# EAGLE design Pico_26Pin_FPC_Adapter (EAGLE 9.6.2)
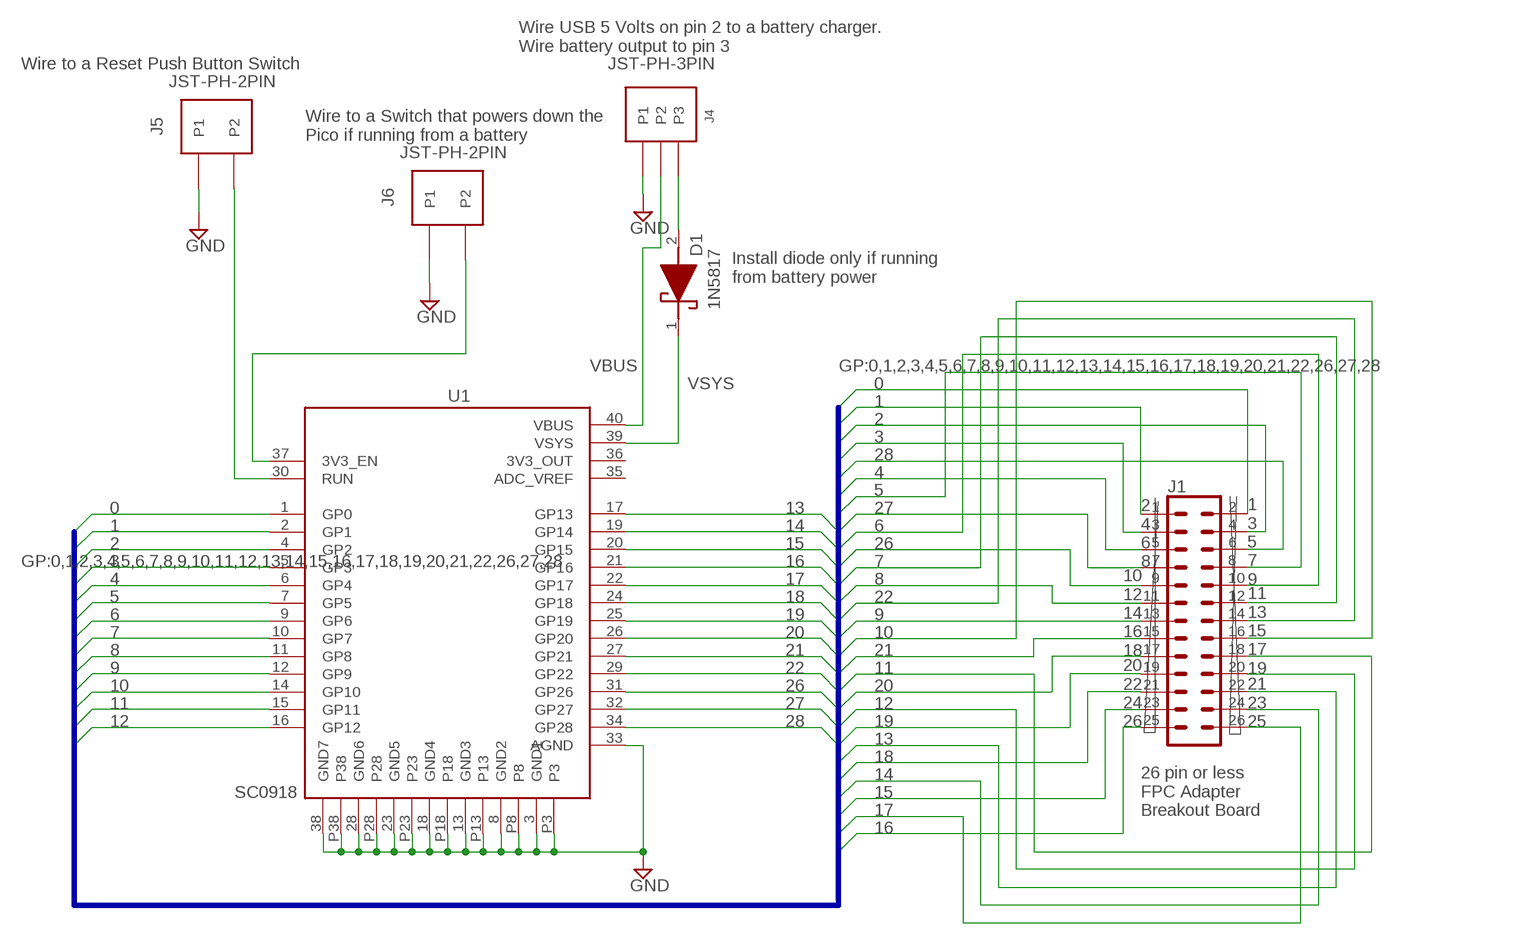
[diagram p0: schematic, sheet 1]

## Parts
D1  1N5817  [DIOAD1410W86L470D235]
J1  CONN_13X22X13  [2X13]
J4  JST-PH-3PIN  [JST-PH-3PIN]
J5  JST-PH-2PIN  [JST-PH-2PIN]
J6  JST-PH-2PIN  [JST-PH-2PIN]
U1  SC0918  [MODULE_SC0918]

## Nets
0: J1.2 U1.1(GP0)
1: J1.1 U1.2(GP1)
2: J1.4 U1.4(GP2)
3: J1.3 U1.5(GP3)
4: J1.5 U1.6(GP4)
5: J1.8 U1.7(GP5)
6: J1.10 U1.9(GP6)
7: J1.12 U1.10(GP7)
8: J1.11 U1.11(GP8)
9: J1.13 U1.12(GP9)
10: J1.16 U1.14(GP10)
11: J1.18 U1.15(GP11)
12: J1.20 U1.16(GP12)
13: J1.22 U1.17(GP13)
14: J1.24 U1.19(GP14)
15: J1.23 U1.20(GP15)
16: J1.25 U1.21(GP16)
17: J1.26 U1.22(GP17)
18: J1.21 U1.24(GP18)
19: J1.19 U1.25(GP19)
20: J1.17 U1.26(GP20)
21: J1.15 U1.27(GP21)
22: J1.14 U1.29(GP22)
26: J1.9 U1.31(GP26)
27: J1.7 U1.32(GP27)
28: J1.6 U1.34(GP28)
GND: J4.P$1(P1) J5.P$1(P1) J6.P$1(P1) U1.3(GND1) U1.8(GND2) U1.13(GND3) U1.18(GND4) U1.23(GND5) U1.28(GND6) U1.33(AGND) U1.38(GND7) U1.P3 U1.P8 U1.P13 U1.P18 U1.P23 U1.P28 U1.P38
N$1: J5.P$2(P2) U1.30(RUN)
N$2: J6.P$2(P2) U1.37(3V3_EN)
VBAT: D1.2(A) J4.P$3(P3)
VBUS: J4.P$2(P2) U1.40(VBUS)
VSYS: D1.1(K) U1.39(VSYS)

## Buses
GP:0,1,2,3,4,5,6,7,8,9,10,11,12,13,14,15,16,17,18,19,20,21,22,26,27,28

## Notes on the sheet
- Wire USB 5 Volts on pin 2 to a battery charger.
  Wire battery output to pin 3
- Wire to a Reset Push Button Switch
- Wire to a Switch that powers down the
  Pico if running from a battery
- Install diode only if running 
  from battery power
- 2
  4
  6
  8
- 1
  3
  5
  7
  9
- 10
  12
  14
  16
  18
- 11
  13
  15
  17
  19
- 20
  22
  24
  26
- 21
  23
  25
- 26 pin or less
  FPC Adapter
  Breakout Board

## Power pins joined to a net without a drawn wire
3V3_OUT: U1.36(3V3_OUT)
ADC_VREF: U1.35(ADC_VREF)

## Library data of the parts
D1 = SamacSys_Parts:1N5817: Schottky Diodes & Rectifiers 1A, 20V, Schottky Rectifier Source: Datasheet <https://services.taiwansemi.com/storage/resources/datasheet/1N5817 SERIES_H2104.pdf>; DESCRIPTION: Schottky Diodes & Rectifiers 1A, 20V, Schottky Rectifier; HEIGHT: mm; MANUFACTURER_NAME: Taiwan Semiconductor; MANUFACTURER_PART_NUMBER: 1N5817; MOUSER_PART_NUMBER: 821-1N5817; MOUSER_PRICE-STOCK: https://www.mouser.co.uk/ProductDetail/Taiwan-Semiconductor/1N5817?qs=G5AQjGfRJcITga2hz4Rc2w%3D%3D
J1 = SparkFun-Connectors:CONN_13X2: Multi connection point. Often used as Generic Header-pin footprint for 0.1 inch spaced/style header connections On any of the 0.1 inch spaced packages, you can populate with these: Break Away Headers - Straight <https://www.sparkfun.com/products/116> (PRT-00116) Break Away Male Headers - Right Angle <https://www.sparkfun.com/products/553> (PRT-00553) Female Headers <https://www.sparkfun.com/products/115> (PRT-00115) Break Away Headers - Machine Pin <https://www.sparkfun.com/products/117> (PRT-00117) Break Away Female Headers - Swiss Machine Pin <https://www.sparkfun.com/products/743> (PRT-00743)
J4 = JST-PH-3PIN:JST-PH-3PIN
J5 J6 = JST-PH-2PIN:JST-PH-2PIN
U1 = SC0918:SC0918: Check availability <https://pricing.snapeda.com/parts/SC0918/Raspberry%20Pi/view-part?ref=eda>; AVAILABILITY: In Stock; CHECK_PRICES: https://www.snapeda.com/parts/SC0918/Raspberry+Pi/view-part/?ref=eda; DESCRIPTION: - RP2040 Transceiver; 802.11 b/g/n (Wi-Fi, WiFi, WLAN), Bluetooth® 5.x 2.4GHz Evaluation Board; MF: Raspberry Pi; MP: SC0918; PACKAGE: None; PRICE: None; SNAPEDA_LINK: https://www.snapeda.com/parts/SC0918/Raspberry+Pi/view-part/?ref=snap

## Board
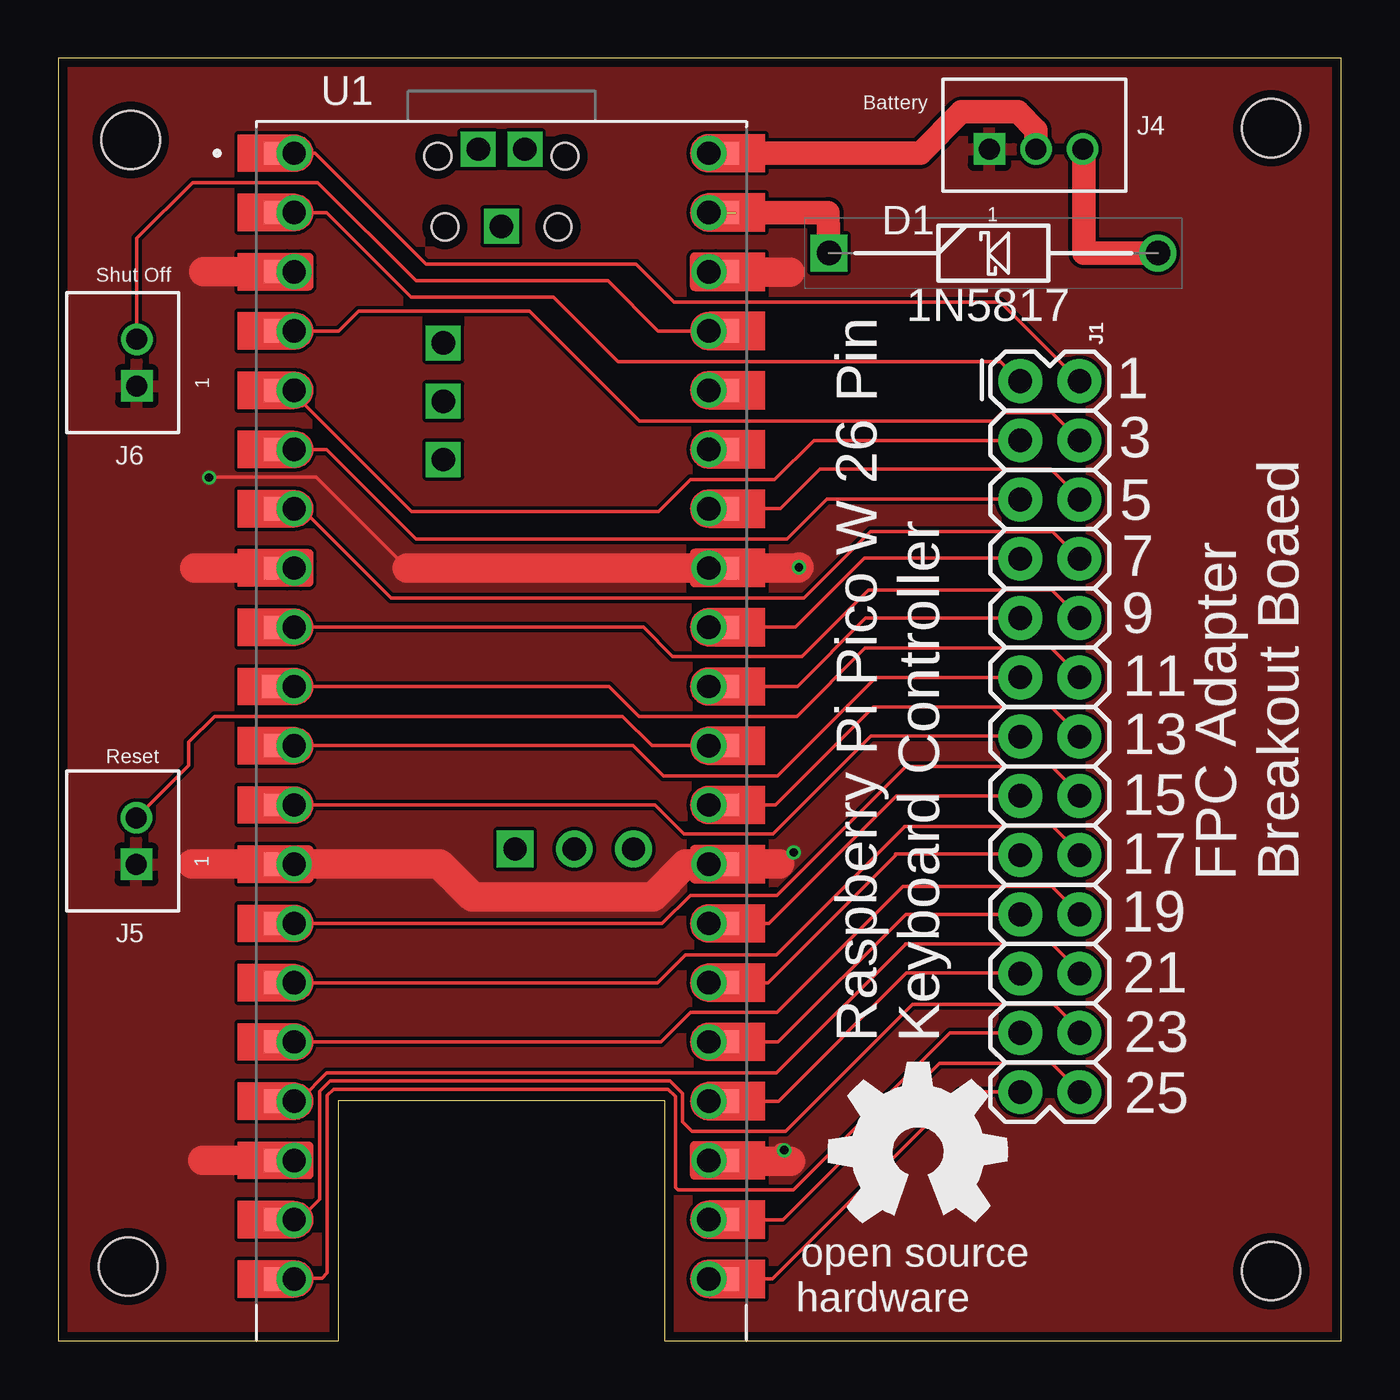
[diagram p1: board, top side]
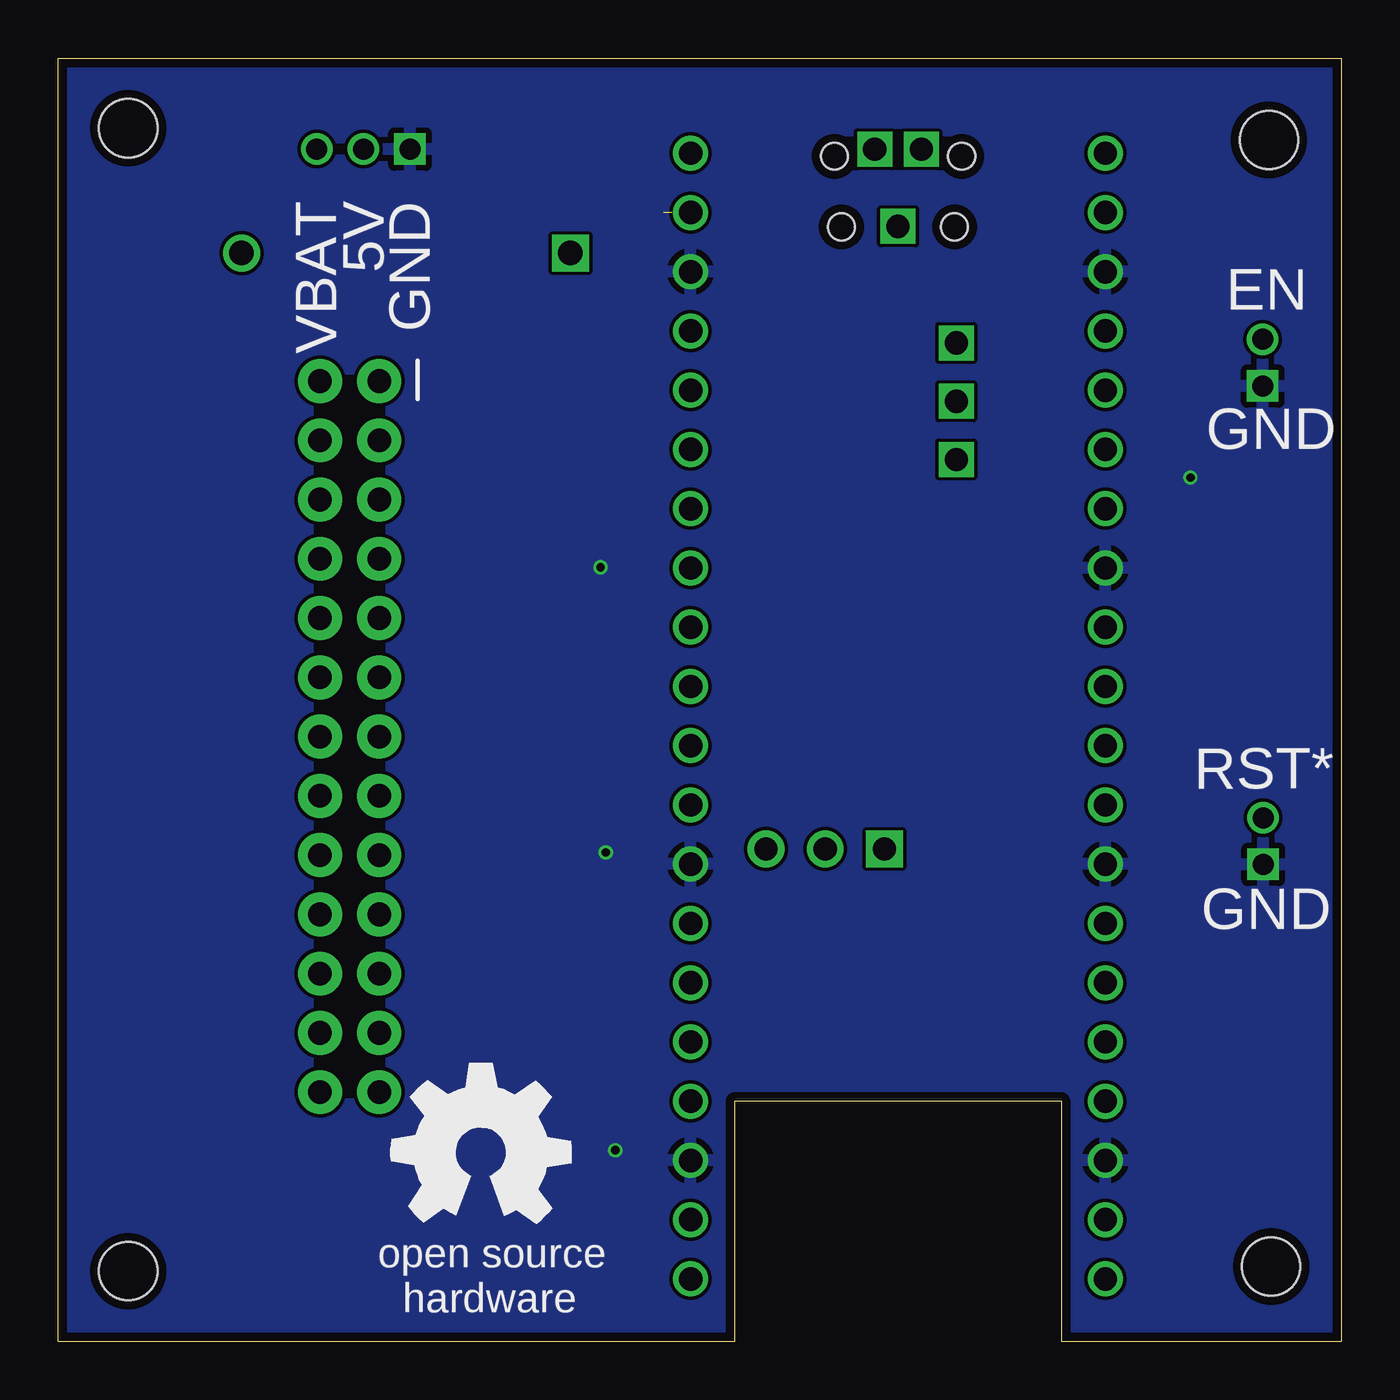
[diagram p2: board, bottom side, seen from below]

Size 55 x 55 mm. Coordinates in mm from the lower left corner, seen from the top.
Outline: 55,0 55,55 0,55 0,0 12,0 12,10.3 26,10.3 26,0 55,0
Copper layers (1*16): Top 0.035559375mm / dielectric 1.6mm / Bottom 0.035559375mm
Design rules "oshpark-2layer": minimum track width 6mil, minimum drill 10mil, track to track 6mil, track to pad 6mil, pad to pad 6mil, via to via 6mil, smd to smd 6mil, copper to edge 15mil, drill to drill 6mil, minimum pad ring 5mil, minimum via ring 5mil, stop-mask expansion 2.5mil, vias tented up to drill 0mil, thermal gap 10mil
Holes 2.5 mm at 52,52 52,3 3,3.2 3.1,51.5

### Footprints (pad centres in the part's own frame; a part is rotated, then mirrored left to right if it is on the bottom)
DIOAD1410W86L470D235 = drill 1.05 pad 1.575 square: 1 0,0 | drill 1.05 pad 1.575: 2 14.1,0
2X13 = drill 1.016 pad 1.88: 1 0,0; 2 0,2.54; 3 2.54,0; 4 2.54,2.54; 5 5.08,0; 6 5.08,2.54; 7 7.62,0; 8 7.62,2.54; 9 10.16,0; 10 10.16,2.54; 11 12.7,0; 12 12.7,2.54; 13 15.24,0; 14 15.24,2.54; 15 17.78,0; 16 17.78,2.54; 17 20.32,0; 18 20.32,2.54; 19 22.86,0; 20 22.86,2.54; 21 25.4,0; 22 25.4,2.54; 23 27.94,0; 24 27.94,2.54; 25 30.48,0; 26 30.48,2.54
JST-PH-3PIN = drill 0.9 square: P$1 -2.98,0.01 | drill 0.9: P$2 -0.98,0.01; P$3 1.02,0.01
JST-PH-2PIN = drill 0.9 square: P$1 -1,0 | drill 0.9: P$2 1,0
MODULE_SC0918 = smd 1 x 1: 1 -9.69,24.13; 2 -9.69,21.59; 3 -9.69,19.05; 4 -9.69,16.51; 5 -9.69,13.97; 6 -9.69,11.43; 7 -9.69,8.89; 8 -9.69,6.35; 9 -9.69,3.81; 10 -9.79,1.27; 11 -9.69,-1.27; 12 -9.69,-3.81; 13 -9.69,-6.35; 14 -9.69,-8.89; 15 -9.69,-11.43; 16 -9.69,-13.97; 17 -9.69,-16.51; 18 -9.69,-19.05; 19 -9.69,-21.59; 20 -9.69,-24.13; 21 9.69,-24.13; 22 9.69,-21.59; 23 9.69,-19.05; 24 9.69,-16.51; 25 9.69,-13.97; 26 9.69,-11.43; 27 9.69,-8.89; 28 9.69,-6.35; 29 9.69,-3.81; 30 9.69,-1.27; 31 9.69,1.27; 32 9.69,3.81; 33 9.69,6.35; 34 9.69,8.89; 35 9.69,11.43; 36 9.69,13.97; 37 9.69,16.51; 38 9.69,19.05; 39 9.69,21.59; 40 9.69,24.13 | drill 1 pad 1.575 square: E 0.584,-5.7 | drill 1 pad 1.575: F 3.124,-5.7; G 5.664,-5.7 | drill 1: P1 -8.89,24.13; P2 -8.89,21.59; P3 -8.89,19.05; P4 -8.89,16.51; P5 -8.89,13.97; P6 -8.89,11.43; P7 -8.89,8.89; P8 -8.89,6.35; P9 -8.89,3.81; P10 -8.89,1.27; P11 -8.89,-1.27; P12 -8.89,-3.81; P13 -8.89,-6.35; P14 -8.89,-8.89; P15 -8.89,-11.43; P16 -8.89,-13.97; P17 -8.89,-16.51; P18 -8.89,-19.05; P19 -8.89,-21.59; P20 -8.89,-24.13; P21 8.89,-24.13; P22 8.89,-21.59; P23 8.89,-19.05; P24 8.89,-16.51; P25 8.89,-13.97; P26 8.89,-11.43; P27 8.89,-8.89; P28 8.89,-6.35; P29 8.89,-3.81; P30 8.89,-1.27; P31 8.89,1.27; P32 8.89,3.81; P33 8.89,6.35; P34 8.89,8.89; P35 8.89,11.43; P36 8.89,13.97; P37 8.89,16.51; P38 8.89,19.05; P39 8.89,21.59; P40 8.89,24.13 | drill 1 pad 1.5 square: TP1 0,21; TP2 1,24.3; TP3 -1,24.3; TP4 -2.5,16; TP5 -2.5,13.5; TP6 -2.5,11 | hole 1.15: -2.425,20.97; 2.425,20.97; -2.725,24; 2.725,24

### Placement (x,y rotation side)
D1  33.04,46.65 0 top
J1  41.24,41.16 270 top
J4  42.9,51.1 0 top
J5  3.35,21.44 90 top
J6  3.37,41.95 90 top
U1  19,26.8 0 top
U$1  [OSHW_8MM]  36.83,8.12 0 top
U$2  [OSHW_8MM]  36.86,8.09 0 top

### Tracks (layer width: path | path; a pad name or v marks a point on that pad's centre or on a via)
0
  Top 0.152: U1.1 11.01,50.93 15.77,46.17 24.77,46.17 26.39,44.55 40.39,44.55 J1.2
1
  Top 0.152: U1.2 11.5,48.39 15.13,44.76 21.23,44.76 23.99,42 40.4,42 J1.1
2
  Top 0.152: U1.4 12.02,43.31 12.87,44.16 20.2,44.16 24.92,39.44 40.08,39.44 40.45,39.81 42.59,39.81 J1.4
3
  Top 0.152: U1.5 9.95,40.77 15.15,35.57 25.74,35.57 27.1,36.93 30.71,36.93 32.4,38.62 J1.3
4
  Top 0.152: U1.6 11.5,38.23 15.34,34.39 31.24,34.39 32.95,36.1 41.22,36.1 J1.5
5
  Top 0.152: U1.7 10.44,35.69 14.27,31.86 31.97,31.86 34.82,34.71 42.61,34.71 J1.8
6
  Top 0.152: U1.9 25.08,30.61 26.33,29.36 31.89,29.36 34.74,32.21 42.59,32.21 43.78,31.02 J1.10
7
  Top 0.152: U1.10 23.61,28.07 24.89,26.79 31.67,26.79 34.59,29.71 42.57,29.71 43.78,28.5 J1.12
8
  Top 0.152: U1.11 24.65,25.53 25.95,24.23 30.83,24.23 35.06,28.46 J1.11
9
  Top 0.152: U1.12 25.58,22.99 26.83,21.74 30.63,21.74 34.84,25.95 41.21,25.95 J1.13
10
  Top 0.152: U1.14 25.89,17.91 27.1,19.12 30.82,19.12 36.1,24.4 36.1,24.41 36.33,24.64 42.59,24.64 43.78,23.45 J1.16
11
  Top 0.152: U1.15 25.69,15.37 26.89,16.57 30.8,16.57 36.28,22.05 36.28,22.06 42.64,22.06 43.78,20.92 J1.18
12
  Top 0.152: U1.16 25.84,12.83 27.1,14.09 30.81,14.09 36.21,19.49 42.59,19.49 J1.20
13
  Top 0.152: U1.17 9.42,10.4 10.4,10.4 11.5,11.5 30.8,11.5 36.31,17.01 36.31,17.04 42.59,17.04 43.78,15.85 J1.22
14
  Top 0.152: U1.19 10.32,5.21 11.2,6.09 11.2,10.7 11.65,11.15 26.22,11.15 26.76,10.62 26.76,9.4 27.16,9 31.17,9 36.61,14.44 42.69,14.44 43.78,13.35 J1.24
15
  Top 0.152: U1.20 9.34,2.7 11.3,2.7 11.53,2.93 11.53,10.53 11.8,10.8 26.15,10.8 26.46,10.49 26.46,6.6 26.56,6.5 31.51,6.5 38.23,13.22 J1.23
16
  Top 0.152: U1.21 30.62,2.67 38.63,10.68 J1.25
17
  Top 0.152: J1.26 43.78,10.72 42.59,11.91 37.77,11.91 31.07,5.21 U1.22
18
  Top 0.152: J1.21 41.22,15.78 36.36,15.78 30.87,10.29 U1.24
19
  Top 0.152: J1.19 36.33,18.3 30.86,12.83 U1.25
20
  Top 0.152: U1.26 30.43,15.37 35.88,20.82 35.88,20.88 41.2,20.88 J1.17
21
  Top 0.152: U1.27 30.47,17.91 35.94,23.38 J1.15
22
  Top 0.152: U1.29 30.75,22.99 34.95,27.19 42.57,27.19 43.78,25.98 J1.14
26
  Top 0.152: J1.9 34.61,31 31.68,28.07 U1.31
27
  Top 0.152: J1.7 41.21,33.57 34.56,33.57 31.6,30.61 U1.32
28
  Top 0.152: J1.6 43.78,36.15 42.55,37.38 32.65,37.38 30.96,35.69 U1.34
GND  (via drill 0.35)
  Top 0.152: 9.38,45.85 U1.3 | U1.P28 28.64,20.45 U1.28 30.29,20.45 30.8,20.96 v31.53,20.96 | v6.46,37.02 6.46,37.04 11.06,37.04 14.95,33.15
  Top 0.61: U1.23 30.54,7.75 30.98,8.19 v31.12,8.19
  Top 1.27: U1.P23 U1.23 | U1.P18 U1.18 6.2,7.75 | 5.74,20.45 U1.13 U1.P13 16.35,20.45 17.75,19.05 25.5,19.05 26.9,20.45 27.8,20.45 28.64,20.45 30.91,20.45 | U1.P8 U1.8 5.84,33.15 | U1.P3 9.38,45.85 | U1.3 6.23,45.85 | U1.P38 28.44,45.85 | 28.44,45.85 U1.38 | v31.75,33.18 31.72,33.15 U1.33 14.95,33.15 | 31.38,7.72 28.27,7.72 | 31.36,45.83 28.46,45.83 28.44,45.85
  pour Top: 0,-0.1 0,54.9 55,54.9 55,-0.1 26,-0.1 26,10.2 12,10.2 12,-0.1
  pour Bottom: -0.1,-0.1 -0.1,54.9 55.1,54.9 55.1,-0.1 26,-0.1 26,10.2 12,10.2 12,-0.1
N$1
  Top 0.152: J5.P$2 5.6,24.69 5.6,25.69 6.7,26.79 24.19,26.79 25.45,25.53 U1.30
N$2
  Top 0.152: J6.P$2 3.37,47.28 5.76,49.67 11.12,49.67 15.33,45.46 23.56,45.46 25.71,43.31 26.73,43.31 U1.37
VBAT
  Top 0.508: 43.96,51.07 J4.P$3
  Top 1.016: D1.2 43.96,46.65 43.96,51.07
VBUS
  Top 1.016: U1.40 36.95,50.93 38.72,52.7 41.14,52.7 41.92,51.92 J4.P$2
VSYS  (1 unrouted)
  Top 0.508: 29.08,48.42 29.05,48.39
  Top 1.016: D1.1 33.01,48.39 U1.39

### Text on the board
tPlace: Battery | Shut Off | 1N5817 | 1 | 3 | 5 | 7 | 9 | 11 | Reset | 13 | 15 | 17 | FPC Adapter / Breakout Boaed | 19 | 21 | Raspberry Pi Pico W 26 Pin / Keyboard Controller | 23 | 25
bPlace: GND | 5V | VBAT | EN | GND | RST* | GND